# EAGLE schematic Schematic_1.0 (EAGLE 9.7.0)
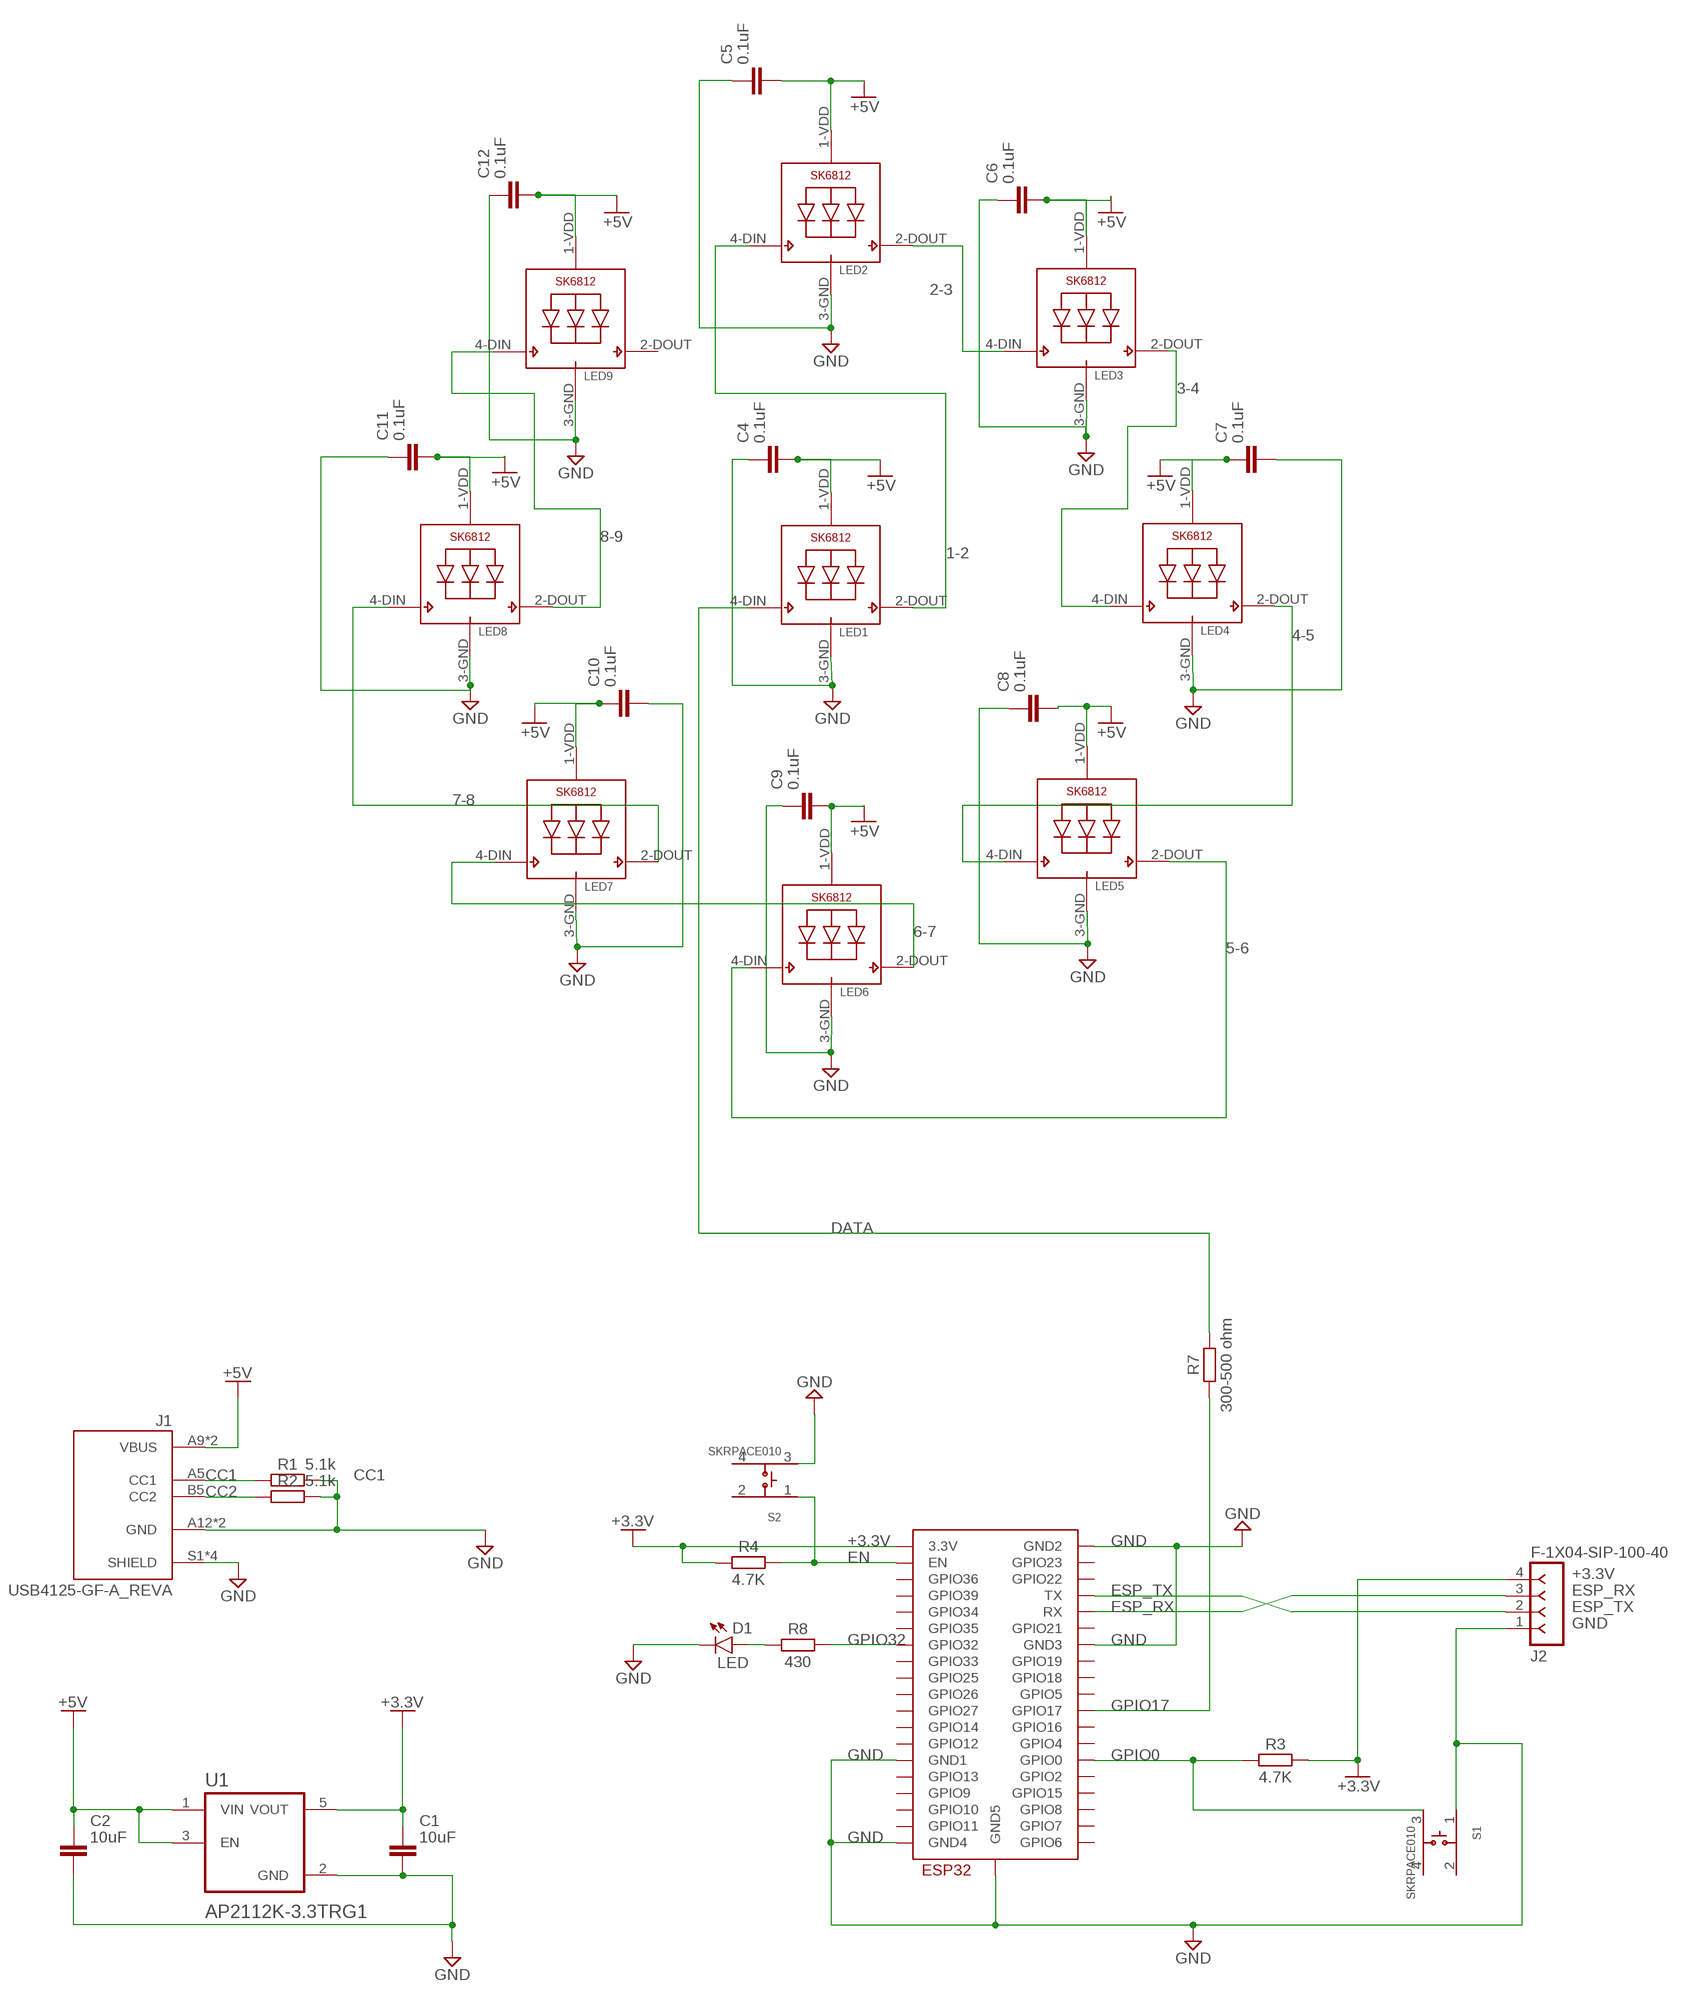
[diagram p0: schematic, sheet 1]

## Parts
C1  10uF  C_CHIP-0603(1608-METRIC)  [CAPC1608X85]
C2  10uF  C_CHIP-0603(1608-METRIC)  [CAPC1608X85]
C4  0.1uF  C_CHIP-0603(1608-METRIC)  [CAPC1608X85]
C5  0.1uF  C_CHIP-0603(1608-METRIC)  [CAPC1608X85]
C6  0.1uF  C_CHIP-0603(1608-METRIC)  [CAPC1608X85]
C7  0.1uF  C_CHIP-0603(1608-METRIC)  [CAPC1608X85]
C8  0.1uF  C_CHIP-0603(1608-METRIC)  [CAPC1608X85]
C9  0.1uF  C_CHIP-0603(1608-METRIC)  [CAPC1608X85]
C10  0.1uF  C_CHIP-0603(1608-METRIC)  [CAPC1608X85]
C11  0.1uF  C_CHIP-0603(1608-METRIC)  [CAPC1608X85]
C12  0.1uF  C_CHIP-0603(1608-METRIC)  [CAPC1608X85]
D1  LED  CHIP-FLAT-R_0603-0.80MM  [LEDC1608X80N_FLAT-R]
J1  USB4125-GF-A_REVA  [GCT_USB4125-GF-A_REVA]
J2  F-1X04-SIP-100-40  [SIP-100-04-40]
LED1  SK6812_5050W  [LED5050_W]
LED2  SK6812_5050W  [LED5050_W]
LED3  SK6812_5050W  [LED5050_W]
LED4  SK6812_5050W  [LED5050_W]
LED5  SK6812_5050W  [LED5050_W]
LED6  SK6812_5050W  [LED5050_W]
LED7  SK6812_5050W  [LED5050_W]
LED8  SK6812_5050W  [LED5050_W]
LED9  SK6812_5050W  [LED5050_W]
R1  5.1k  R_CHIP-0603(1608-METRIC)  [RESC1608X60]
R2  5.1k  R_CHIP-0603(1608-METRIC)  [RESC1608X60]
R3  4.7K  R_CHIP-0603(1608-METRIC)  [RESC1608X60]
R4  4.7K  R_CHIP-0603(1608-METRIC)  [RESC1608X60]
R7  300-500 ohm  R_CHIP-0603(1608-METRIC)  [RESC1608X60]
R8  430  R_CHIP-0603(1608-METRIC)  [RESC1608X60]
S1  SKRPACE010  [SW_SKRPACE010]
S2  SKRPACE010  [SW_SKRPACE010]
U1  AP2112K-3.3TRG1  [SOT95P285X140-5N]
U2  ESP32-WROOM  [ESP32-WROOM]

## Nets
1-2: LED1.2-DOUT(DO) LED2.4-DIN(DI)
2-3: LED2.2-DOUT(DO) LED3.4-DIN(DI)
3-4: LED3.2-DOUT(DO) LED4.4-DIN(DI)
4-5: LED4.2-DOUT(DO) LED5.4-DIN(DI)
5-6: LED5.2-DOUT(DO) LED6.4-DIN(DI)
6-7: LED6.2-DOUT(DO) LED7.4-DIN(DI)
7-8: LED7.2-DOUT(DO) LED8.4-DIN(DI)
8-9: LED8.2-DOUT(DO) LED9.4-DIN(DI)
+3.3V [5V]: C1.1 J2.4 R3.2 R4.1 U1.5(VOUT) U2.3V3(3.3V)
+5V [5V]: C2.1 C4.2 C5.2 C6.2 C7.1 C8.2 C9.2 C10.1 C11.2 C12.2 J1.A9(VBUS) J1.B9(VBUS) LED1.1-VDD(VDD) LED2.1-VDD(VDD) LED3.1-VDD(VDD) LED4.1-VDD(VDD) LED5.1-VDD(VDD) LED6.1-VDD(VDD) LED7.1-VDD(VDD) LED8.1-VDD(VDD) LED9.1-VDD(VDD) U1.1(VIN) U1.3(EN)
CC1: J1.A5(CC1) R1.1
CC2: J1.B5(CC2) R2.1
DATA: LED1.4-DIN(DI) R7.2
EN: R4.2 S2.1 U2.EN
ESP_RX: J2.3 U2.RX
ESP_TX: J2.2 U2.TX
GND [GND]: C1.2 C2.2 C4.1 C5.1 C6.1 C7.2 C8.1 C9.1 C10.2 C11.1 C12.1 D1.C J1.A12(GND) J1.B12(GND) J1.S1(SHIELD) J1.S2(SHIELD) J1.S3(SHIELD) J1.S4(SHIELD) J2.1 LED1.3-GND(GND) LED2.3-GND(GND) LED3.3-GND(GND) LED4.3-GND(GND) LED5.3-GND(GND) LED6.3-GND(GND) LED7.3-GND(GND) LED8.3-GND(GND) LED9.3-GND(GND) R1.2 R2.2 S1.1 S2.3 U1.2(GND) U2.GND1 U2.GND2 U2.GND3 U2.GND4 U2.GND5
GPIO0: R3.1 S1.3 U2.IO0(GPIO0)
GPIO17: R7.1 U2.IO17(GPIO17)
GPIO32: R8.2 U2.IO32(GPIO32)
LED: D1.A R8.1
Unconnected: LED9.2-DOUT(DO) S1.2 S1.4 S2.2 S2.4 U2.CLK(GPIO6) U2.CMD(GPIO11) U2.IO2(GPIO2) U2.IO4(GPIO4) U2.IO5(GPIO5) U2.IO12(GPIO12) U2.IO13(GPIO13) U2.IO14(GPIO14) U2.IO15(GPIO15) U2.IO16(GPIO16) U2.IO18(GPIO18) U2.IO19(GPIO19) U2.IO21(GPIO21) U2.IO22(GPIO22) U2.IO23(GPIO23) U2.IO25(GPIO25) U2.IO26(GPIO26) U2.IO27(GPIO27) U2.IO33(GPIO33) U2.IO34(GPIO34) U2.IO35(GPIO35) U2.SD0(GPIO7) U2.SD1(GPIO8) U2.SD2(GPIO9) U2.SD3(GPIO10) U2.SENSOR_VN(GPIO39) U2.SENSOR_VP(GPIO36)

## Library data of the parts
C1 C2 C4-C12 = Capacitor:C: Capacitor - Generic; CATEGORY: Capacitor
D1 = LED:CHIP-FLAT-R; CATEGORY: LED; COLOR: RED; DESCRIPTION: CHIP LED FLAT; SUB-CATEGORY: CHIP; TYPE: FLAT_TOP; VALUE: LED_RED
J1 = USB4125-GF-A_REVA model:USB4125-GF-A_REVA: USB 2.0 Type C Receptacle, Horizontal, SMT, For Power charging Check prices <https://pricing.snapeda.com/parts/USB4125-GF-A/Global%20Connector%20Technology/view-part?ref=eda>; AVAILABILITY: Warning; DESCRIPTION: USB Charge Only Connector Type C Horizontal Receptacle, 3.16mm profile, 6 Pins, Surface mount, Top mount, low cost; MF: Global Connector Technology; MP: USB4125-GF-A; PACKAGE: None; PRICE: None; PURCHASE-URL: https://pricing.snapeda.com/search/part/USB4125-GF-A/?ref=eda
J2 = con-headers-jp:F-1X04-: FEMALE HEADER
LED1-LED9 = SK6812:SK6812
R1-R4 R7 R8 = Resistor:R: Resistor Fixed - Generic; CATEGORY: Resistor; SUB-CATEGORY: Fixed
S1 S2 = SKRPACE010:SKRPACE010: Switch Tactile N.O. SPST Button J-Bend 0.05A 16VDC 2.55N SMD Automotive T/R; MANUFACTURER: ALPS; STANDARD: Maniufacturer Recommendations
U1 = AP2112K-3.3TRG1:AP2112K-3.3TRG1: AP2112 Series 0.6 A 3.3 V Fixed Output SMT LDO Linear Regulator - SOT23-5; MANUFACTURER: Diodes Inc.; PARTREV: 2-2
U2 = ESP32:ESP32-WROOM

## Net classes
0 default: width 0.254 mm
1 5V: width 0.635 mm
2 GND: width 0.635 mm